# EAGLE design quad.exp.vca.main (EAGLE 7.5.0)
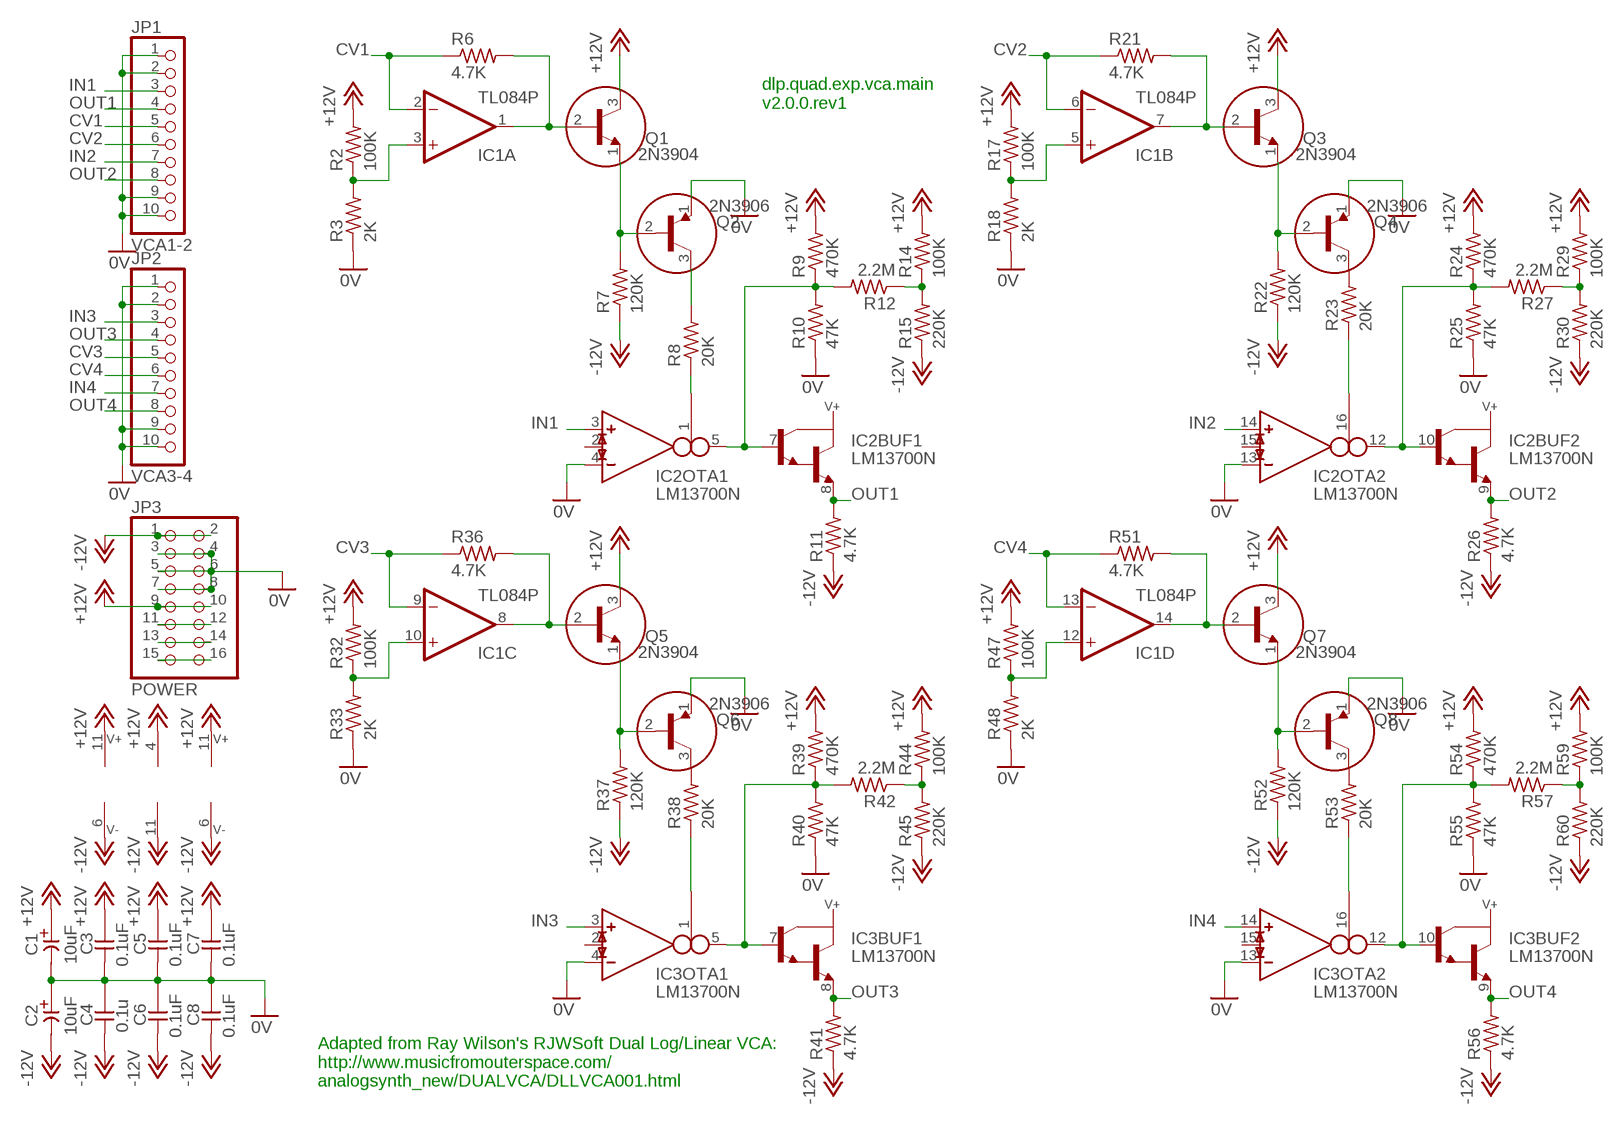
[diagram p0: schematic, sheet 1]

## Parts
C1  10uF  CE-USE2-5  [E2-5]
C2  10uF  CE-USE2-5  [E2-5]
C3  0.1uF  CC-US025-024X044  [C025-024X044]
C4  0.1u  CC-US025-024X044  [C025-024X044]
C5  0.1uF  CC-US025-024X044  [C025-024X044]
C6  0.1uF  CC-US025-024X044  [C025-024X044]
C7  0.1uF  CC-US025-024X044  [C025-024X044]
C8  0.1uF  CC-US025-024X044  [C025-024X044]
IC1  TL084P  [DIL14]
IC2  LM13700N  [DIL16]
IC3  LM13700N  [DIL16]
JP1  VCA1-2  PINHD-1X10  [1X10]
JP2  VCA3-4  PINHD-1X10  [1X10]
JP3  POWER  PINHD-2X8  [2X08]
Q1  2N3904  [TO92]
Q2  2N3906  [TO92]
Q3  2N3904  [TO92]
Q4  2N3906  [TO92]
Q5  2N3904  [TO92]
Q6  2N3906  [TO92]
Q7  2N3904  [TO92]
Q8  2N3906  [TO92]
R2  100K  R-US_0207/7  [0207/7]
R3  2K  R-US_0207/7  [0207/7]
R6  4.7K  R-US_0207/7  [0207/7]
R7  120K  R-US_0207/7  [0207/7]
R8  20K  R-US_0207/7  [0207/7]
R9  470K  R-US_0207/7  [0207/7]
R10  47K  R-US_0207/7  [0207/7]
R11  4.7K  R-US_0207/7  [0207/7]
R12  2.2M  R-US_0207/7  [0207/7]
R14  100K  R-US_0207/7  [0207/7]
R15  220K  R-US_0207/7  [0207/7]
R17  100K  R-US_0207/7  [0207/7]
R18  2K  R-US_0207/7  [0207/7]
R21  4.7K  R-US_0207/7  [0207/7]
R22  120K  R-US_0207/7  [0207/7]
R23  20K  R-US_0207/7  [0207/7]
R24  470K  R-US_0207/7  [0207/7]
R25  47K  R-US_0207/7  [0207/7]
R26  4.7K  R-US_0207/7  [0207/7]
R27  2.2M  R-US_0207/7  [0207/7]
R29  100K  R-US_0207/7  [0207/7]
R30  220K  R-US_0207/7  [0207/7]
R32  100K  R-US_0207/7  [0207/7]
R33  2K  R-US_0207/7  [0207/7]
R36  4.7K  R-US_0207/7  [0207/7]
R37  120K  R-US_0207/7  [0207/7]
R38  20K  R-US_0207/7  [0207/7]
R39  470K  R-US_0207/7  [0207/7]
R40  47K  R-US_0207/7  [0207/7]
R41  4.7K  R-US_0207/7  [0207/7]
R42  2.2M  R-US_0207/7  [0207/7]
R44  100K  R-US_0207/7  [0207/7]
R45  220K  R-US_0207/7  [0207/7]
R47  100K  R-US_0207/7  [0207/7]
R48  2K  R-US_0207/7  [0207/7]
R51  4.7K  R-US_0207/7  [0207/7]
R52  120K  R-US_0207/7  [0207/7]
R53  20K  R-US_0207/7  [0207/7]
R54  470K  R-US_0207/7  [0207/7]
R55  47K  R-US_0207/7  [0207/7]
R56  4.7K  R-US_0207/7  [0207/7]
R57  2.2M  R-US_0207/7  [0207/7]
R59  100K  R-US_0207/7  [0207/7]
R60  220K  R-US_0207/7  [0207/7]

## Nets
0V: C1.- C2.+ C3.2 C4.1 C5.2 C6.1 C7.2 C8.1 IC2.4(OTA1:IN_N) IC2.13(OTA2:IN_N) IC3.4(OTA1:IN_N) IC3.13(OTA2:IN_N) JP1.1 JP1.2 JP1.9 JP1.10 JP2.1 JP2.2 JP2.9 JP2.10 JP3.3 JP3.4 JP3.5 JP3.6 JP3.7 JP3.8 Q2.1(E) Q4.1(E) Q6.1(E) Q8.1(E) R3.1 R10.1 R18.1 R25.1 R33.1 R40.1 R48.1 R55.1
+12V: C1.+ C3.1 C5.1 C7.1 IC1.4(P:V+) IC2.11(SUPPLY:V+) IC3.11(SUPPLY:V+) JP3.9 JP3.10 Q1.3(C) Q3.3(C) Q5.3(C) Q7.3(C) R2.2 R9.2 R14.2 R17.2 R24.2 R29.2 R32.2 R39.2 R44.2 R47.2 R54.2 R59.2
-12V: C2.- C4.2 C6.2 C8.2 IC1.11(P:V-) IC2.6(SUPPLY:V-) IC3.6(SUPPLY:V-) JP3.1 JP3.2 R7.1 R11.1 R15.1 R22.1 R26.1 R30.1 R37.1 R41.1 R45.1 R52.1 R56.1 R60.1
CV1: IC1.2(A:-IN) JP1.5 R6.1
CV2: IC1.6(B:-IN) JP1.6 R21.1
CV3: IC1.9(C:-IN) JP2.5 R36.1
CV4: IC1.13(D:-IN) JP2.6 R51.1
IN1: IC2.3(OTA1:IN_P) JP1.3
IN2: IC2.14(OTA2:IN_P) JP1.7
IN3: IC3.3(OTA1:IN_P) JP2.3
IN4: IC3.14(OTA2:IN_P) JP2.7
N$3: IC1.3(A:+IN) R2.1 R3.2
N$5: IC1.10(C:+IN) R32.1 R33.2
N$6: IC1.1(A:OUT) Q1.2(B) R6.2
N$7: Q1.1(E) Q2.2(B) R7.2
N$9: Q2.3(C) R8.2
N$10: IC1.8(C:OUT) Q5.2(B) R36.2
N$14: Q5.1(E) Q6.2(B) R37.2
N$15: IC2.5(OTA1:OUT) IC2.7(BUF1:B) R9.1 R10.2 R12.2
N$17: Q4.3(C) R23.2
N$20: IC3.5(OTA1:OUT) IC3.7(BUF1:B) R39.1 R40.2 R42.2
N$21: IC2.1(OTA1:I_BIAS) R8.1
N$25: IC1.5(B:+IN) R17.1 R18.2
N$27: IC3.1(OTA1:I_BIAS) R38.1
N$28: IC1.7(B:OUT) Q3.2(B) R21.2
N$29: Q3.1(E) Q4.2(B) R22.2
N$30: Q8.3(C) R53.2
N$34: IC1.12(D:+IN) R47.1 R48.2
N$35: IC2.10(BUF2:B) IC2.12(OTA2:OUT) R24.1 R25.2 R27.2
N$39: IC1.14(D:OUT) Q7.2(B) R51.2
N$40: Q7.1(E) Q8.2(B) R52.2
N$41: Q6.3(C) R38.2
N$44: IC2.16(OTA2:I_BIAS) R23.1
N$45: IC3.10(BUF2:B) IC3.12(OTA2:OUT) R54.1 R55.2 R57.2
N$48: IC3.16(OTA2:I_BIAS) R53.1
N$49: R12.1 R14.1 R15.2
N$50: R27.1 R29.1 R30.2
N$51: R42.1 R44.1 R45.2
N$52: R57.1 R59.1 R60.2
N$55: JP3.11 JP3.12
N$56: JP3.13 JP3.14
N$57: JP3.15 JP3.16
OUT1: IC2.8(BUF1:E) JP1.4 R11.2
OUT2: IC2.9(BUF2:E) JP1.8 R26.2
OUT3: IC3.8(BUF1:E) JP2.4 R41.2
OUT4: IC3.9(BUF2:E) JP2.8 R56.2
Unconnected: IC2.2(OTA1:I_DIODE) IC2.15(OTA2:I_DIODE) IC3.2(OTA1:I_DIODE) IC3.15(OTA2:I_DIODE)

## Notes on the sheet
- dlp.quad.exp.vca.main
  v2.0.0.rev1
- Adapted from Ray Wilson's RJWSoft Dual Log/Linear VCA:
  http://www.musicfromouterspace.com/
  analogsynth_new/DUALVCA/DLLVCA001.html

## Library data of the parts
C1 C2 = _common:CE-US: ELECTROLYTIC CAPACITOR, US symbol
C3-C8 = _common:CC-US: CAPACITOR, US symbol
IC1 = linear:TL084: OP AMP
IC2 IC3 = ota:LM13700: Dual OTA with buffers
JP1 JP2 = pinhead:PINHD-1X10: PIN HEADER
JP3 = pinhead:PINHD-2X8: PIN HEADER
Q1 Q3 Q5 Q7 = _common:2N3904
Q2 Q4 Q6 Q8 = _common:2N3906: PNP Transistor
R2 R3 R6-R12 R14 R15 R17 R18 R21-R27 R29 R30 R32 R33 R36-R42 R44 R45 R47 R48 R51-R57 R59 R60 = resistor:R-US_: RESISTOR, American symbol

## Board
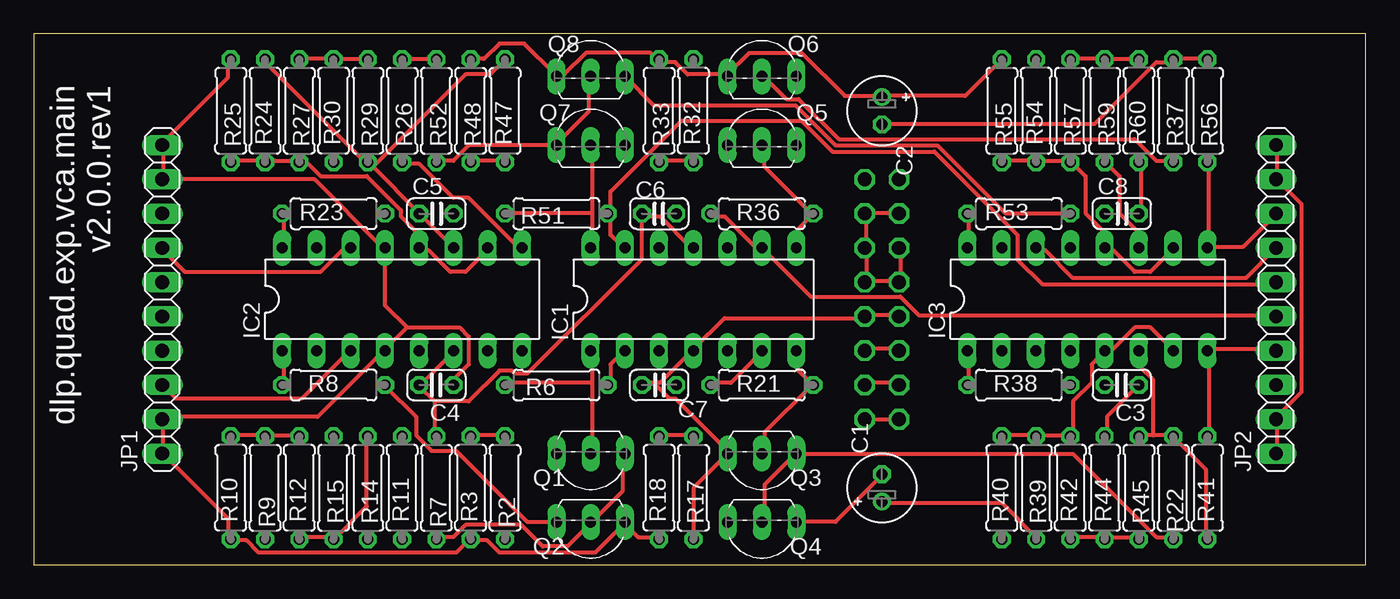
[diagram p1: board, top side]
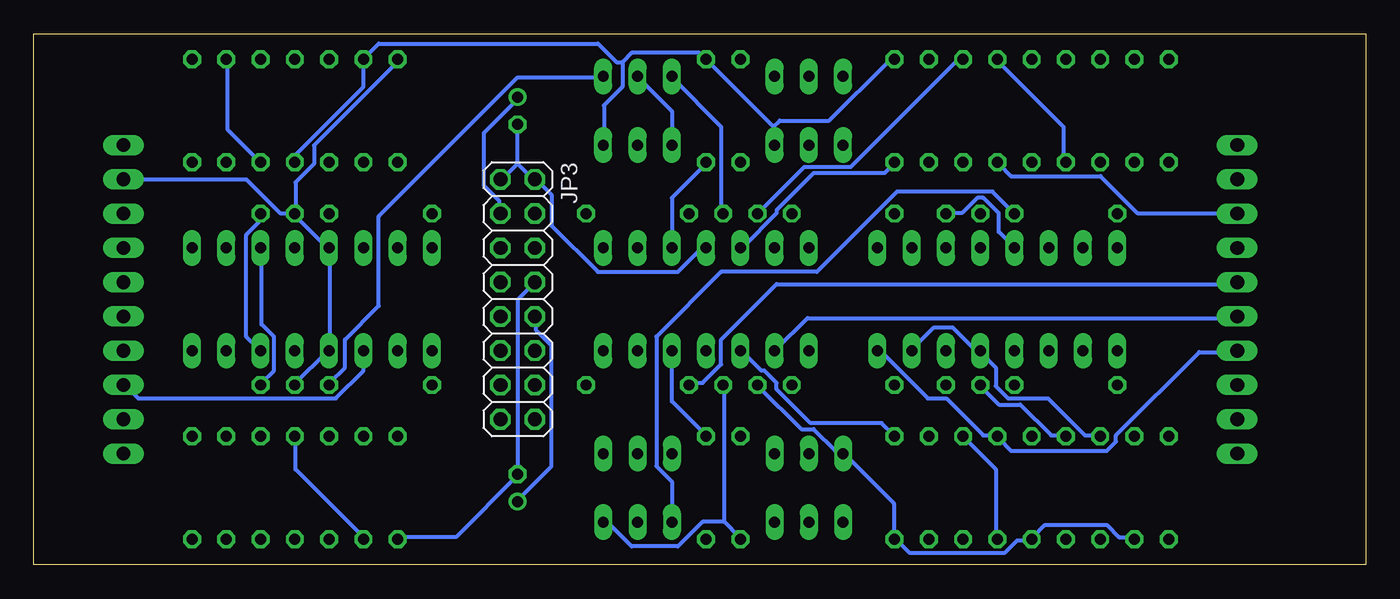
[diagram p2: board, bottom side, seen from below]

Size 98.73 x 39.36 mm. Coordinates in mm from the lower left corner, seen from the top.
Outline: 0,0 98.73,0 98.73,39.36 0,39.36 0,0
Copper layers (1*16): Top 0.035mm / dielectric 1.5mm / Bottom 0.035mm
Design rules "SeeedStudio_2layer_DRU_no_angle_20140221 *": minimum track width 12mil, minimum drill 12mil, track to track 6mil, track to pad 6mil, pad to pad 6mil, via to via 6mil, smd to smd 0mil, copper to edge 10mil, drill to drill 10mil, minimum pad ring 10mil, minimum via ring 6mil, stop-mask expansion 2mil, vias tented up to drill 100mil, thermal gap 10mil

### Footprints (pad centres in the part's own frame; a part is rotated, then mirrored left to right if it is on the bottom)
E2-5 = drill 0.813 pad 1.27: + -1.016,0 | drill 0.813 pad 1.27 octagon: - 1.016,0
C025-024X044 = drill 0.813 octagon: 1 -1.27,0; 2 1.27,0
DIL14 = drill 0.813 long: 1 -7.62,-3.81; 2 -5.08,-3.81; 3 -2.54,-3.81; 4 0,-3.81; 5 2.54,-3.81; 6 5.08,-3.81; 7 7.62,-3.81; 8 7.62,3.81; 9 5.08,3.81; 10 2.54,3.81; 11 0,3.81; 12 -2.54,3.81; 13 -5.08,3.81; 14 -7.62,3.81
DIL16 = drill 0.813 long: 1 -8.89,-3.81; 2 -6.35,-3.81; 3 -3.81,-3.81; 4 -1.27,-3.81; 5 1.27,-3.81; 6 3.81,-3.81; 7 6.35,-3.81; 8 8.89,-3.81; 9 8.89,3.81; 10 6.35,3.81; 11 3.81,3.81; 12 1.27,3.81; 13 -1.27,3.81; 14 -3.81,3.81; 15 -6.35,3.81; 16 -8.89,3.81
1X10 = drill 1.016 long: 1 -11.43,0; 2 -8.89,0; 3 -6.35,0; 4 -3.81,0; 5 -1.27,0; 6 1.27,0; 7 3.81,0; 8 6.35,0; 9 8.89,0; 10 11.43,0
2X08 = drill 1.016 octagon: 1 -8.89,-1.27; 2 -8.89,1.27; 3 -6.35,-1.27; 4 -6.35,1.27; 5 -3.81,-1.27; 6 -3.81,1.27; 7 -1.27,-1.27; 8 -1.27,1.27; 9 1.27,-1.27; 10 1.27,1.27; 11 3.81,-1.27; 12 3.81,1.27; 13 6.35,-1.27; 14 6.35,1.27; 15 8.89,-1.27; 16 8.89,1.27
TO92 = drill 0.813 long: 1 -2.54,-1.27; 2 0,-1.27; 3 2.54,-1.27
0207/7 = drill 0.813 octagon: 1 -3.81,0; 2 3.81,0

### Placement (x,y rotation side)
C1  62.87,5.71 90 top
C2  62.87,33.66 270 top
C3  80.64,13.34 180 top
C4  29.84,13.34 180 top
C5  29.84,26.04 0 top
C6  46.35,26.04 180 top
C7  46.35,13.34 0 top
C8  80.64,26.04 0 top
IC1  48.9,19.68 0 top
IC2  27.3,19.68 0 top
IC3  78.11,19.68 0 top
JP1  9.53,19.68 90 top
JP2  92.08,19.68 90 top
JP3  62.87,19.68 270 bottom
Q1  41.27,6.99 180 top
Q2  41.27,1.91 180 top
Q3  53.98,6.99 180 top
Q4  53.98,1.91 180 top
Q5  53.98,32.38 0 top
Q6  53.98,37.47 0 top
Q7  41.27,32.38 0 top
Q8  41.27,37.47 0 top
R2  34.92,5.71 270 top
R3  32.38,5.71 90 top
R6  38.73,13.34 180 top
R7  29.84,5.71 270 top
R8  22.23,13.34 0 top
R9  17.14,5.71 270 top
R10  14.61,5.71 90 top
R11  27.3,5.71 90 top
R12  19.68,5.71 90 top
R14  24.77,5.71 270 top
R15  22.23,5.71 270 top
R17  48.9,5.71 270 top
R18  46.35,5.71 90 top
R21  53.98,13.34 0 top
R22  84.45,5.71 270 top
R23  22.23,26.04 0 top
R24  17.14,33.66 90 top
R25  14.61,33.66 270 top
R26  27.3,33.66 270 top
R27  19.68,33.66 270 top
R29  24.77,33.66 270 top
R30  22.23,33.66 90 top
R32  48.9,33.66 90 top
R33  46.35,33.66 270 top
R36  53.98,26.04 0 top
R37  84.45,33.66 270 top
R38  73.03,13.34 0 top
R39  74.3,5.71 270 top
R40  71.75,5.71 90 top
R41  87,5.71 90 top
R42  76.83,5.71 90 top
R44  79.38,5.71 90 top
R45  81.92,5.71 270 top
R47  34.92,33.66 90 top
R48  32.38,33.66 270 top
R51  38.73,26.04 180 top
R52  29.84,33.66 270 top
R53  73.03,26.04 0 top
R54  74.3,33.66 90 top
R55  71.75,33.66 270 top
R56  87,33.66 270 top
R57  76.83,33.66 270 top
R59  79.38,33.66 270 top
R60  81.92,33.66 90 top

### Tracks (layer width: path | path; a pad name or v marks a point on that pad's centre or on a via)
0V
  Top 0.305: R25.1 14.4,37.26 14.4,36.12 9.6,31.32 JP1.10 9.6,31.09 9.6,28.57 | 27.66,17.6 31.55,17.6 32.23,16.92 32.23,14.86 31.32,13.95 31.32,13.49 C4.1 | 27.66,17.6 26.06,16 IC2.4 25.83,15.77 21.03,10.97 9.6,10.97 JP1.2 9.6,10.74 9.6,8.46 JP1.1 9.6,8.23 14.4,3.43 14.4,2.06 R10.1 14.63,1.83 15.77,1.83 16.69,0.91 31.32,0.91 32.23,1.83 R3.1 32.46,1.83 33.6,1.83 34.52,0.91 41.6,0.91 43.66,2.97 Q2.1 43.89,2.97 44.81,2.06 46.18,2.06 R18.1 | 27.66,17.6 26.06,19.2 26.06,23.32 IC2.13 25.83,23.55 20.8,28.57 9.6,28.57 | 9.6,28.57 JP1.9 | Q4.1 56.69,3.2 59.44,3.2 62.87,6.63 C1.- | JP2.1 92.13,8.46 92.13,10.74 JP2.2 92.13,10.97 93.95,12.8 93.95,26.75 92.13,28.57 | 92.13,28.57 92.13,31.09 JP2.10 | 92.13,28.57 JP2.9 | JP3.3 64.01,26.06 61.72,26.06 JP3.4 61.72,25.83 61.72,23.55 JP3.6 61.72,23.32 61.72,21.03 | JP3.5 64.24,23.32 64.24,21.03 JP3.7 64.01,21.03 61.72,21.03 | 61.72,21.03 JP3.8 | 62.87,34.75 69.04,34.75 R55.1 | R48.1 32.46,37.49 33.38,37.49 34.52,38.63 36.35,38.63 38.63,36.35 Q8.1 38.86,36.35 39.32,36.35 40.92,37.95 45.72,37.95 46.18,37.49 R33.1 46.41,37.26 47.55,37.26 48.46,36.35 51.44,36.35 | 62.87,34.75 60.12,34.75 56.92,37.95 53.03,37.95 51.44,36.35 | 62.87,34.75 C2.+ | 51.44,36.35 Q6.1
  Bottom 0.305: C5.2 31.09,26.06 29.95,26.06 28.8,27.2 28.35,27.2 27.2,26.06 27.2,24.69 26.06,23.55 IC2.13 | R40.1 71.55,2.06 67.44,2.06 62.87,6.63 C1.- 62.87,19.66 61.72,20.8 JP3.8 | 47.55,3.2 47.55,13.26 C7.2 | 47.55,3.2 46.41,2.06 R18.1 | 47.55,3.2 49.15,3.2 50.98,1.37 54.41,1.37 56.01,2.97 56.46,2.97 Q4.1 | C3.2 79.32,13.49 77.04,15.77 IC3.4 76.81,16 76.81,23.32 IC3.13 77.04,23.55 79.32,25.83 C8.1 | JP2.9 82.98,28.57 80.47,26.06 79.55,26.06 C8.1 | JP3.3 64.24,26.06 64.24,26.98 65.38,28.12 65.38,32 62.87,34.52 C2.+ | C6.1 47.78,26.06 47.78,32.46 51.44,36.12 Q6.1 | C8.1 79.32,26.06 79.32,28.35 77.95,29.72 77.95,31.09 71.78,37.26 R55.1
+12V
  Top 0.305: R17.2 48.92,2.06 48.92,5.71 51.44,8.23 Q3.3 51.44,8.46 47.55,12.34 47.09,12.34 45.95,13.49 | JP3.9 64.01,18.52 61.72,18.52 JP3.10 61.49,18.29 51.21,18.29 48.92,16 IC1.4 48.69,15.77 46.41,13.49 45.95,13.49 | 45.95,13.49 45.26,13.49 C7.1 | 28.57,26.06 31.09,23.55 IC2.11 | 28.57,26.06 25.15,29.49 | 25.15,29.49 24.92,29.72 R29.2 | 28.57,26.06 C5.1 | R24.2 17.14,37.26 24.69,29.72 R29.2 | 25.15,29.49 32,36.35 33.83,36.35 34.75,37.26 R47.2 | 25.15,29.49 R29.2 | IC3.11 81.84,23.55 81.84,24.69 80.47,26.06 80.47,28.8 79.55,29.72 R59.2 | C3.1 79.55,10.97 79.55,9.6 R44.2 | C1.+ 62.87,4.57 71.78,4.57 74.3,2.06 R39.2
  Bottom 0.305: R9.2 17.14,2.06 18.29,2.06 19.2,2.97 23.77,2.97 24.69,2.06 R14.2 24.92,1.83 25.83,1.83 26.75,0.91 33.83,0.91 34.75,1.83 R2.2 34.98,2.06 34.98,4.57 38.63,8.23 Q1.3 38.86,8.46 39.32,8.46 40.92,10.06 41.83,10.06 45.03,13.26 C7.1 | 43.89,32.46 43.89,31.32 Q7.3 | 43.89,32.46 R32.2 49.38,37.95 54.41,37.95 55.09,37.26 | 43.89,32.46 43.43,32.92 39.78,32.92 35.43,37.26 34.98,37.26 R47.2 | 55.09,37.26 55.09,35.43 56.46,34.06 56.46,31.32 Q5.3 | R59.2 79.32,29.95 79.32,30.4 74.3,35.43 R54.2 74.3,37.49 73.15,38.63 56.92,38.63 55.55,37.26 55.09,37.26 | R44.2 79.32,9.37 79.32,7.09 74.3,2.06 R39.2 | IC3.11 81.84,23.32 81.84,17.83 80.92,16.92 80.92,14.4 81.84,13.49 C3.1 | JP3.10 61.49,18.29 61.49,17.37 60.35,16.23 60.35,7.32 62.87,4.8 C1.+
-12V
  Top 0.305: R56.1 86.87,37.49 84.58,37.49 R37.1 84.35,37.26 83.21,37.26 78.64,32.69 62.87,32.69 C2.- | C8.2 82.07,26.06 82.07,29.72 R60.1 | 82.98,9.6 84.35,9.6 R22.1 84.58,9.37 86.87,7.09 86.87,2.06 R41.1 | 82.98,9.6 82.07,9.6 R45.1 | 82.98,9.6 82.98,13.72 82.07,14.63 82.07,15.77 IC3.6 | 28.57,13.26 31.09,15.77 IC2.6 | 29.72,12.12 29.72,9.6 R7.1 | 28.57,13.26 29.72,12.12 | 28.57,13.26 C4.2 | R52.1 29.72,37.49 27.43,37.49 R26.1 | IC1.11 48.69,23.55 46.41,25.83 45.26,25.83 C6.2 45.03,25.83 45.03,22.63 36.58,14.17 35.66,14.17 35.43,14.4 34.52,14.4 32.23,12.12 29.72,12.12
  Bottom 0.305: R37.1 84.35,37.26 84.35,32.23 82.07,29.95 R60.1 | C8.2 82.07,25.83 82.07,25.38 82.98,24.46 82.98,16.92 82.07,16 IC3.6 | R11.1 27.43,2.06 27.43,7.09 29.72,9.37 R7.1 | R15.1 22.4,9.6 23.32,9.6 25.6,11.89 27.2,11.89 28.57,13.26 C4.2 | R30.1 22.4,29.95 22.4,32.46 27.2,37.26 R26.1 | 62.87,29.72 C2.- | 62.87,29.72 61.72,28.57 JP3.2 61.49,28.57 60.35,27.43 60.35,25.15 56.92,21.72 50.98,21.72 49.38,23.32 48.92,23.32 IC1.11 | 62.87,29.72 64.01,28.57 JP3.1 | R52.1 29.95,37.26 30.4,37.26 38.18,29.49 41.6,29.49 45.03,26.06 C6.2
CV1
  Top 0.305: R6.1 42.75,13.49 42.75,14.86 43.66,15.77 IC1.2
  Bottom 0.305: JP1.5 9.6,18.29 41.38,18.29 43.66,16 IC1.2
CV2
  Top 0.305: R21.1 50.29,13.49 51.66,13.49 53.95,15.77 IC1.6
  Bottom 0.305: JP1.6 9.6,20.8 43.66,20.8 47.78,16.69 47.78,14.86 49.15,13.49 50.06,13.49 R21.1
CV3
  Top 0.305: R36.1 50.29,25.83 51.21,25.83 53.49,23.55 53.95,23.55 IC1.9 54.18,23.32 57.61,19.89 64.24,19.89 65.61,18.52 91.9,18.52 JP2.5
CV4
  Top 0.305: IC1.13 43.66,23.55 42.75,24.46 42.75,25.83 R51.1 42.75,26.06 42.75,27.66 48.01,32.92 56.92,32.92 59.21,30.63 66.75,30.63 72.92,24.46 72.92,22.63 74.75,20.8 91.9,20.8 JP2.6
IN1
  Top 0.305: JP1.3 10.52,12.34 19.89,12.34 23.32,15.77 IC2.3
IN2
  Top 0.305: IC2.14 23.32,23.32 22.86,23.32 21.26,21.72 11.2,21.72 9.6,23.32 JP1.7
IN3
  Bottom 0.305: IC3.3 74.3,14.4 76.35,12.34 90.98,12.34 91.9,13.26 JP2.3
IN4
  Top 0.305: JP2.7 89.84,21.26 77.04,21.26 74.98,23.32 74.3,23.32 IC3.14
N$3
  Top 0.305: R3.2 32.46,9.6 34.75,9.6 R2.1
  Bottom 0.305: IC1.3 46.18,15.77 44.81,14.4 44.58,14.4 43.66,13.49 43.66,13.03 41.15,10.52 35.89,10.52 34.98,9.6 R2.1
N$5
  Top 0.305: R33.2 46.41,29.95 48.69,29.95 R32.1
  Bottom 0.305: IC1.10 51.44,27.2 48.92,29.72 R32.1
N$6
  Top 0.305: 41.38,13.49 41.38,15.77 IC1.1 | 41.38,13.49 41.38,8.46 Q1.2 | 41.38,13.49 34.98,13.49 R6.2
N$7
  Top 0.305: R7.2 29.95,2.06 31.09,2.06 32,2.97 36.12,2.97 37.72,1.37 39.55,1.37 41.15,2.97 Q2.2 41.38,3.2 43.66,5.49 43.66,8.23 Q1.1
N$9
  Top 0.305: Q2.3 38.63,3.2 36.58,3.2 31.32,8.46 29.49,8.46 28.35,9.6 28.35,10.97 26.06,13.26 R8.2
N$10
  Top 0.305: IC1.8 56.69,23.55 56.69,24.92 57.61,25.83 R36.2 57.61,26.06 54.18,29.49 54.18,31.09 Q5.2
N$14
  Top 0.305: R37.2 84.35,29.95 83.21,29.95 81.61,31.55 59.66,31.55 56.69,34.52 55.78,34.52 54.18,36.12 Q6.2
  Bottom 0.305: Q5.1 51.44,33.6 53.95,36.12 Q6.2
N$15
  Top 0.305: 17.14,9.6 14.63,9.6 R10.2 | 17.14,9.6 19.66,9.6 R12.2 | 17.14,9.6 R9.1
  Bottom 0.305: IC2.7 33.6,16 32,17.6 30.63,17.6 29.03,16 28.57,16 IC2.5 28.57,15.77 27.43,14.63 27.43,13.26 26.52,12.34 23.55,12.34 20.8,9.6 19.89,9.6 R12.2
N$17
  Bottom 0.305: Q4.3 51.44,6.17 52.58,7.32 52.58,16.92 47.78,21.72 40.69,21.72 34.75,27.66 27.66,27.66 R23.2
N$20
  Top 0.305: 74.3,9.6 71.78,9.6 R40.2 | 74.3,9.6 76.81,9.6 R42.2 77.04,9.6 77.04,12.12 78.41,13.49 78.41,14.86 79.32,15.77 IC3.5 79.55,16 80.01,16 81.61,17.6 82.75,17.6 84.35,16 IC3.7 | 74.3,9.6 R39.1
N$21
  Top 0.305: R8.1 18.52,13.49 18.52,15.77 IC2.1
N$25
  Top 0.305: R18.2 46.41,9.6 48.69,9.6 R17.1
  Bottom 0.305: IC1.5 51.44,12.12 48.92,9.6 R17.1
N$27
  Top 0.305: R38.1 69.27,13.49 69.27,15.77 IC3.1
N$28
  Top 0.305: Q3.2 54.18,8.46 54.18,9.83 57.61,13.26 R21.2 57.61,13.49 56.69,14.4 56.69,15.77 IC1.7
N$29
  Top 0.305: Q4.2 54.18,3.2 54.18,5.94 56.46,8.23 Q3.1 56.69,8.23 77.04,8.23 83.21,2.06 84.35,2.06 R22.2
N$30
  Top 0.305: Q8.3 45.95,34.06 56.46,34.06 59.44,31.09 66.98,31.09 72.01,26.06 76.81,26.06 R53.2
N$34
  Top 0.305: R48.2 32.46,29.95 34.75,29.95 R47.1
  Bottom 0.305: IC1.12 46.18,23.55 43.66,26.06 43.66,26.29 40.92,29.03 35.66,29.03 34.98,29.72 R47.1
N$35
  Top 0.305: IC2.10 33.6,23.32 32,21.72 30.86,21.72 29.26,23.32 28.57,23.32 IC2.12 28.57,24.46 27.2,25.83 27.2,26.29 24.69,28.8 21.26,28.8 20.34,29.72 19.89,29.72 R27.2 19.66,29.95 17.14,29.95 | 17.14,29.95 14.63,29.95 R25.2 | 17.14,29.95 R24.1
N$39
  Top 0.305: 41.38,26.06 41.38,31.09 Q7.2 | 41.38,26.06 41.38,23.55 IC1.14 | 41.38,26.06 34.98,26.06 R51.2
N$40
  Top 0.305: R52.2 29.95,29.95 31.09,29.95 32.23,31.09 38.63,31.09 Q7.1 38.86,31.32 41.15,33.6 41.15,36.12 Q8.2
N$41
  Bottom 0.305: Q6.3 56.69,36.12 62.87,36.12 73.15,25.83 73.15,19.2 75.67,16.69 75.67,14.63 76.81,13.49 R38.2
N$44
  Top 0.305: IC2.16 18.52,23.55 18.52,25.83 R23.1
N$45
  Top 0.305: IC3.10 84.35,23.32 82.75,21.72 81.61,21.72 80.01,23.32 79.55,23.32 IC3.12 79.32,23.55 79.32,24.69 77.95,26.06 77.95,28.8 77.04,29.72 R57.2 76.81,29.95 74.3,29.95 | 74.3,29.95 71.78,29.95 R55.2 | 74.3,29.95 R54.1
N$48
  Top 0.305: IC3.16 69.27,23.55 69.27,25.83 R53.1
N$49
  Top 0.305: R12.1 19.89,2.06 22.17,2.06 R15.2 22.4,2.06 24.69,4.34 24.69,9.37 R14.1
N$50
  Top 0.305: R27.1 19.89,37.49 22.17,37.49 R30.2 22.4,37.49 24.69,37.49 R29.1
N$51
  Top 0.305: R42.1 77.04,2.06 79.32,2.06 R44.1 79.55,2.06 81.84,2.06 R45.2
N$52
  Top 0.305: R57.1 77.04,37.49 79.32,37.49 R59.1 79.55,37.49 81.84,37.49 R60.2
N$55
  Top 0.305: JP3.12 61.72,16 64.01,16 JP3.11
N$56
  Top 0.305: JP3.14 61.72,13.49 64.01,13.49 JP3.13
N$57
  Top 0.305: JP3.16 61.72,10.74 64.01,10.74 JP3.15
OUT1
  Bottom 0.305: IC2.8 36.12,16 32.46,12.34 31.09,12.34 28.35,9.6 27.43,9.6 R11.2 27.2,9.37 26.29,8.46 19.2,8.46 18.52,9.14 18.52,9.6 12.34,15.77 9.6,15.77 JP1.4
OUT2
  Top 0.305: R26.2 27.43,29.72 28.57,29.72 31.09,27.2 32.23,27.2 36.12,23.32 IC2.9
  Bottom 0.305: JP1.8 9.6,26.06 16.92,26.06 19.66,28.8 26.29,28.8 27.2,29.72 R26.2
OUT3
  Top 0.305: R41.2 87.1,9.6 87.1,15.77 IC3.8 87.1,16 91.9,16 JP2.4
OUT4
  Top 0.305: 87.1,23.55 89.61,23.55 91.9,25.83 JP2.8 | 87.1,23.55 87.1,29.72 R56.2 | 87.1,23.55 IC3.9

### Text on the board
tNames: dlp.quad.exp.vca.main / v2.0.0.rev1